# Altium schematic sheet Main.SchDoc
size A4; SheetNumber: 1; SheetTotal: 8
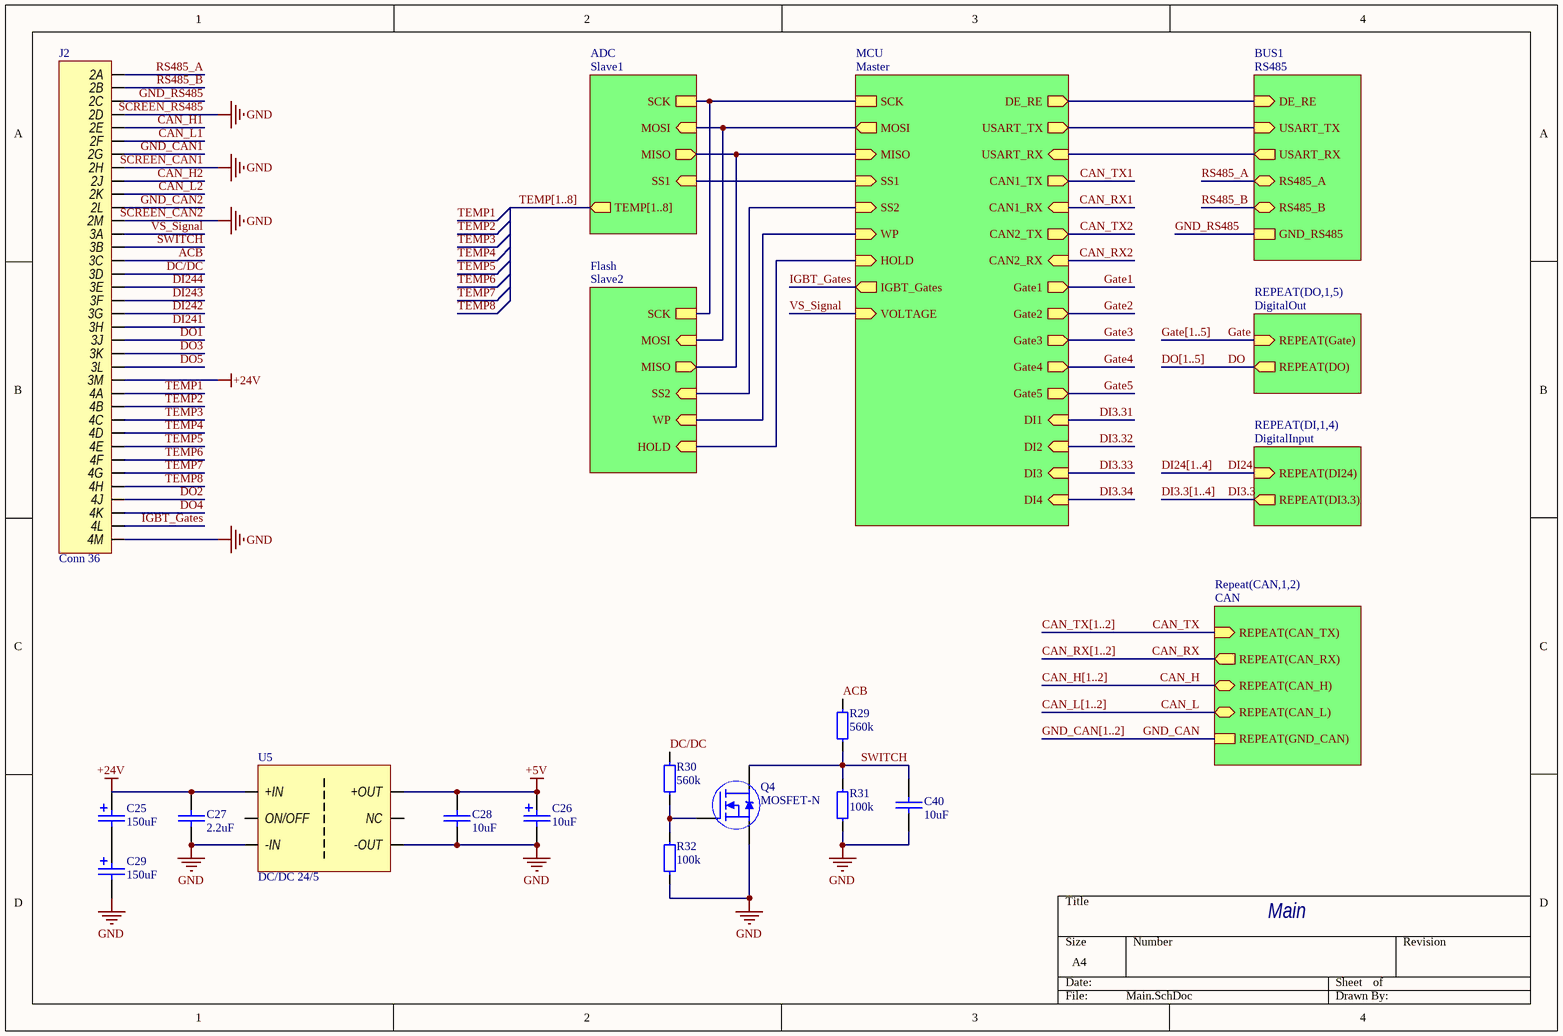
[diagram p0: Main.SchDoc]

## Parts
C25  150uF  [TANTAL_D_CASE]
C26  10uF  [TANTAL_C_CASE]
C27  2.2uF  [0603 Capicator]
C28  10uF  [0603 Capicator]
C29  150uF  [TANTAL_D_CASE]
C40  10uF  [0603 Capicator]
J2  Conn 36  [Molex_477320361]
Q4  MOSFET-N  [SOT-23]
R29  560k  [0603 Resistor]
R30  560k  [0603 Resistor]
R31  100k  [0603 Resistor]
R32  100k  [0603 Resistor]
U5  DC/DC 24/5  [VDRI10(6)]

## Sub-sheets
ADC = Slave1: TEMP[1..8] (out), MISO (out), SS1 (in), MOSI (in), SCK
BUS1 = RS485: USART_TX (in), USART_RX (out), DE_RE (in), RS485_A (bidir), RS485_B (bidir), GND_RS485
Flash = Slave2: MISO (out), SS2 (in), MOSI (in), SCK, WP (in), HOLD (in)
MCU = Master: DE_RE (out), USART_TX (out), USART_RX (in), CAN1_TX (out), CAN1_RX (in), CAN2_TX (out), CAN2_RX (in), VOLTAGE (in), IGBT_Gates (out), MISO (in), MOSI (out), SCK, WP (in), HOLD (in), SS1 (in), SS2 (in), Gate1 (out), Gate2 (out), Gate3 (out), Gate4 (out), Gate5 (out), DI1 (in), DI2 (in), DI3 (in), DI4 (in)
Repeat(CAN,1,2) = CAN: REPEAT(CAN_TX) (in), REPEAT(CAN_RX) (out), REPEAT(CAN_H) (bidir), REPEAT(CAN_L) (bidir), REPEAT(GND_CAN)
REPEAT(DI,1,4) = DigitalInput: REPEAT(DI24) (in), REPEAT(DI3.3) (out)
REPEAT(DO,1,5) = DigitalOut: REPEAT(Gate) (in), REPEAT(DO) (out)

## Nets
+5V: C26.2 C28.2 U5.9(+OUT)
+24V: C25.2 C27.2 J2.3M U5.16(+IN)
GND: C26.1 C27.1 C28.1 C29.1 C40.1 J2.2D J2.2H J2.2M J2.4M Q4.2(Source) R31.1 R32.1 U5.1(-IN) U5.10(-OUT)
ACB: J2.3C R29.2
CAN_H: sheet Repeat(CAN,1,2)/REPEAT(CAN_H)
CAN_H1: J2.2E
CAN_H2: J2.2J
CAN_L: sheet Repeat(CAN,1,2)/REPEAT(CAN_L)
CAN_L1: J2.2F
CAN_L2: J2.2K
CAN_RX: sheet Repeat(CAN,1,2)/REPEAT(CAN_RX)
CAN_RX1: sheet MCU/CAN1_RX
CAN_RX2: sheet MCU/CAN2_RX
CAN_TX: sheet Repeat(CAN,1,2)/REPEAT(CAN_TX)
CAN_TX1: sheet MCU/CAN1_TX
CAN_TX2: sheet MCU/CAN2_TX
DC/DC: J2.3D R30.2
DI3.3: sheet REPEAT(DI,1,4)/REPEAT(DI3.3)
DI3.31: sheet MCU/DI1
DI3.32: sheet MCU/DI2
DI3.33: sheet MCU/DI3
DI3.34: sheet MCU/DI4
DI24: sheet REPEAT(DI,1,4)/REPEAT(DI24)
DI241: J2.3H
DI242: J2.3G
DI243: J2.3F
DI244: J2.3E
DO: sheet REPEAT(DO,1,5)/REPEAT(DO)
DO1: J2.3J
DO2: J2.4J
DO3: J2.3K
DO4: J2.4K
DO5: J2.3L
Gate: sheet REPEAT(DO,1,5)/REPEAT(Gate)
Gate1: sheet MCU/Gate1
Gate2: sheet MCU/Gate2
Gate3: sheet MCU/Gate3
Gate4: sheet MCU/Gate4
Gate5: sheet MCU/Gate5
GND_CAN: sheet Repeat(CAN,1,2)/REPEAT(GND_CAN)
GND_CAN1: J2.2G
GND_CAN2: J2.2L
GND_RS485: J2.2C ; sheet BUS1/GND_RS485
IGBT_Gates: J2.4L ; sheet MCU/IGBT_Gates
RS485_A: J2.2A ; sheet BUS1/RS485_A
RS485_B: J2.2B ; sheet BUS1/RS485_B
SWITCH: C40.2 J2.3B Q4.3(Drain) R29.1 R31.2
TEMP1: J2.4A
TEMP2: J2.4B
TEMP3: J2.4C
TEMP4: J2.4D
TEMP5: J2.4E
TEMP6: J2.4F
TEMP7: J2.4G
TEMP8: J2.4H
VS_Signal: J2.3A ; sheet MCU/VOLTAGE
NetC25_1: C25.1 C29.2
NetQ4_1: Q4.1(Gate) R30.1 R32.2
(unnamed): sheet MCU/DE_RE, sheet BUS1/DE_RE
(unnamed): sheet MCU/USART_TX, sheet BUS1/USART_TX
(unnamed): sheet MCU/USART_RX, sheet BUS1/USART_RX
(unnamed): sheet MCU/MISO, sheet ADC/MISO, sheet Flash/MISO
(unnamed): sheet MCU/MOSI, sheet ADC/MOSI, sheet Flash/MOSI
(unnamed): sheet MCU/SCK, sheet ADC/SCK, sheet Flash/SCK
(unnamed): sheet MCU/WP, sheet Flash/WP
(unnamed): sheet MCU/HOLD, sheet Flash/HOLD
(unnamed): sheet MCU/SS1, sheet ADC/SS1
(unnamed): sheet MCU/SS2, sheet Flash/SS2

Not connected (* = marked no-connect by the designer): U5 2(ON/OFF) 8(NC)

## Buses and harness runs
bus CAN_H[1..2]
bus CAN_L[1..2]
bus CAN_RX[1..2]
bus CAN_TX[1..2]
bus DI3.3[1..4]
bus DI24[1..4]
bus DO[1..5]
bus Gate[1..5]
bus GND_CAN[1..2]
bus TEMP[1..8] = sheet ADC/TEMP[1..8]

## Notes on the sheet
- (near J2) SCREEN_RS485
- (near J2) SCREEN_CAN1
- (near J2) SCREEN_CAN2
- Main

## Library data of the parts
C25 C29 = Cap Tantal 150uF (SMDD): TECAP, 150uF, 16V, case D, 10%; Part Number: 293D157X9010D2TE3; Manufacturer: Vishay; Type: Capacitor; ComponentLink1Description: Chip&Dip; ComponentLink1URL: https://www.chipdip.ru/product0/8018239339
C26 = Cap Tantal 10uF (SMDC): TECAP, 10uF, 35V, case C, 10%; Part Number: TECAP10/35VC10; Manufacturer: China; Type: Capacitor; ComponentLink1Description: Chip&Dip; ComponentLink1URL: https://www.chipdip.ru/product/tecap-10-mkf-35-v-tip-c-10
C27 = Cap 2.2uF (0603): 2.2uF X5R 50V 10% 0603; Manufacturer: Murata Manufacturing; Part Number: GRM188R61H225KE11D; Type: Capacitor; ComponentLink1Description: Chip&Dip; ComponentLink1URL: https://www.chipdip.ru/product/grm188r61h225ke11d-murata
C28 C40 = Cap 10uF (0603): 10uF X5R 25V 20% 0603; Manufacturer: Murata Manufacturing; Part Number: GRM188R61E106M; Type: Capacitor; ComponentLink1Description: Chip&Dip; ComponentLink1URL: https://www.chipdip.ru/product/grm188r61e106m
J2 = Conn 36 (Molex): Molec 36 pin PCB Header 477320361; Manufacturer: Molex; Type: Connector; Part Number: 477320361; ComponentLink1Description: ChipDip; ComponentLink1URL: https://www.chipdip.ru/product0/8004298252; ComponentLink2Description: Promelec; ComponentLink2URL: https://www.promelec.ru/product/427663/; ComponentLink3Description: Datasheet; ComponentLink3URL: https://static.chipdip.ru/lib/848/DOC011848025.pdf
Q4 = MOSFET-N [IRLML]: VDS 30V,  VGS Max ± 20V, RDS 27-40mΩ,; Part Number: IRLML0030TRPBF; Manufacturer: Infineon Technologies; Type: Transistor; ComponentLink1Description: DataSheet; ComponentLink1URL: https://static.chipdip.ru/lib/300/DOC000300382.pdf; ComponentLink2Description: Chip&Dip; ComponentLink2URL: https://www.chipdip.ru/product/irlml0030trpbf
R29 R30 = Res 560k (0603): 0.1W 0603 560k, 1%; Part Number: RC0603FR-07560KL; Manufacturer: Taiwan; Type: Resistor; ComponentLink1Description: Chip&Dip; ComponentLink1URL: https://www.chipdip.ru/product0/9000079778
R31 R32 = Res 100k (0603): 0.1W 0603 100k, 1%; Part Number: RC0603FR-07100KL; Manufacturer: Taiwan; Type: Resistor; ComponentLink1Description: Chip&Dip; ComponentLink1URL: https://www.chipdip.ru/product0/9000079760
U5 = VDRI10B05: DC/DC converter 24/5 10W; Manufacturer: Voltbricks; Part Number: VDRI10B05; Type: IC; ComponentLink2Description: Datasheet; ComponentLink2URL: https://support.voltbricks.ru/datasheets/VDRI10.pdf?1689593019